# EAGLE schematic OSSI-1 COMMS (EAGLE 6.5.0)

## Sheet 1 of 4
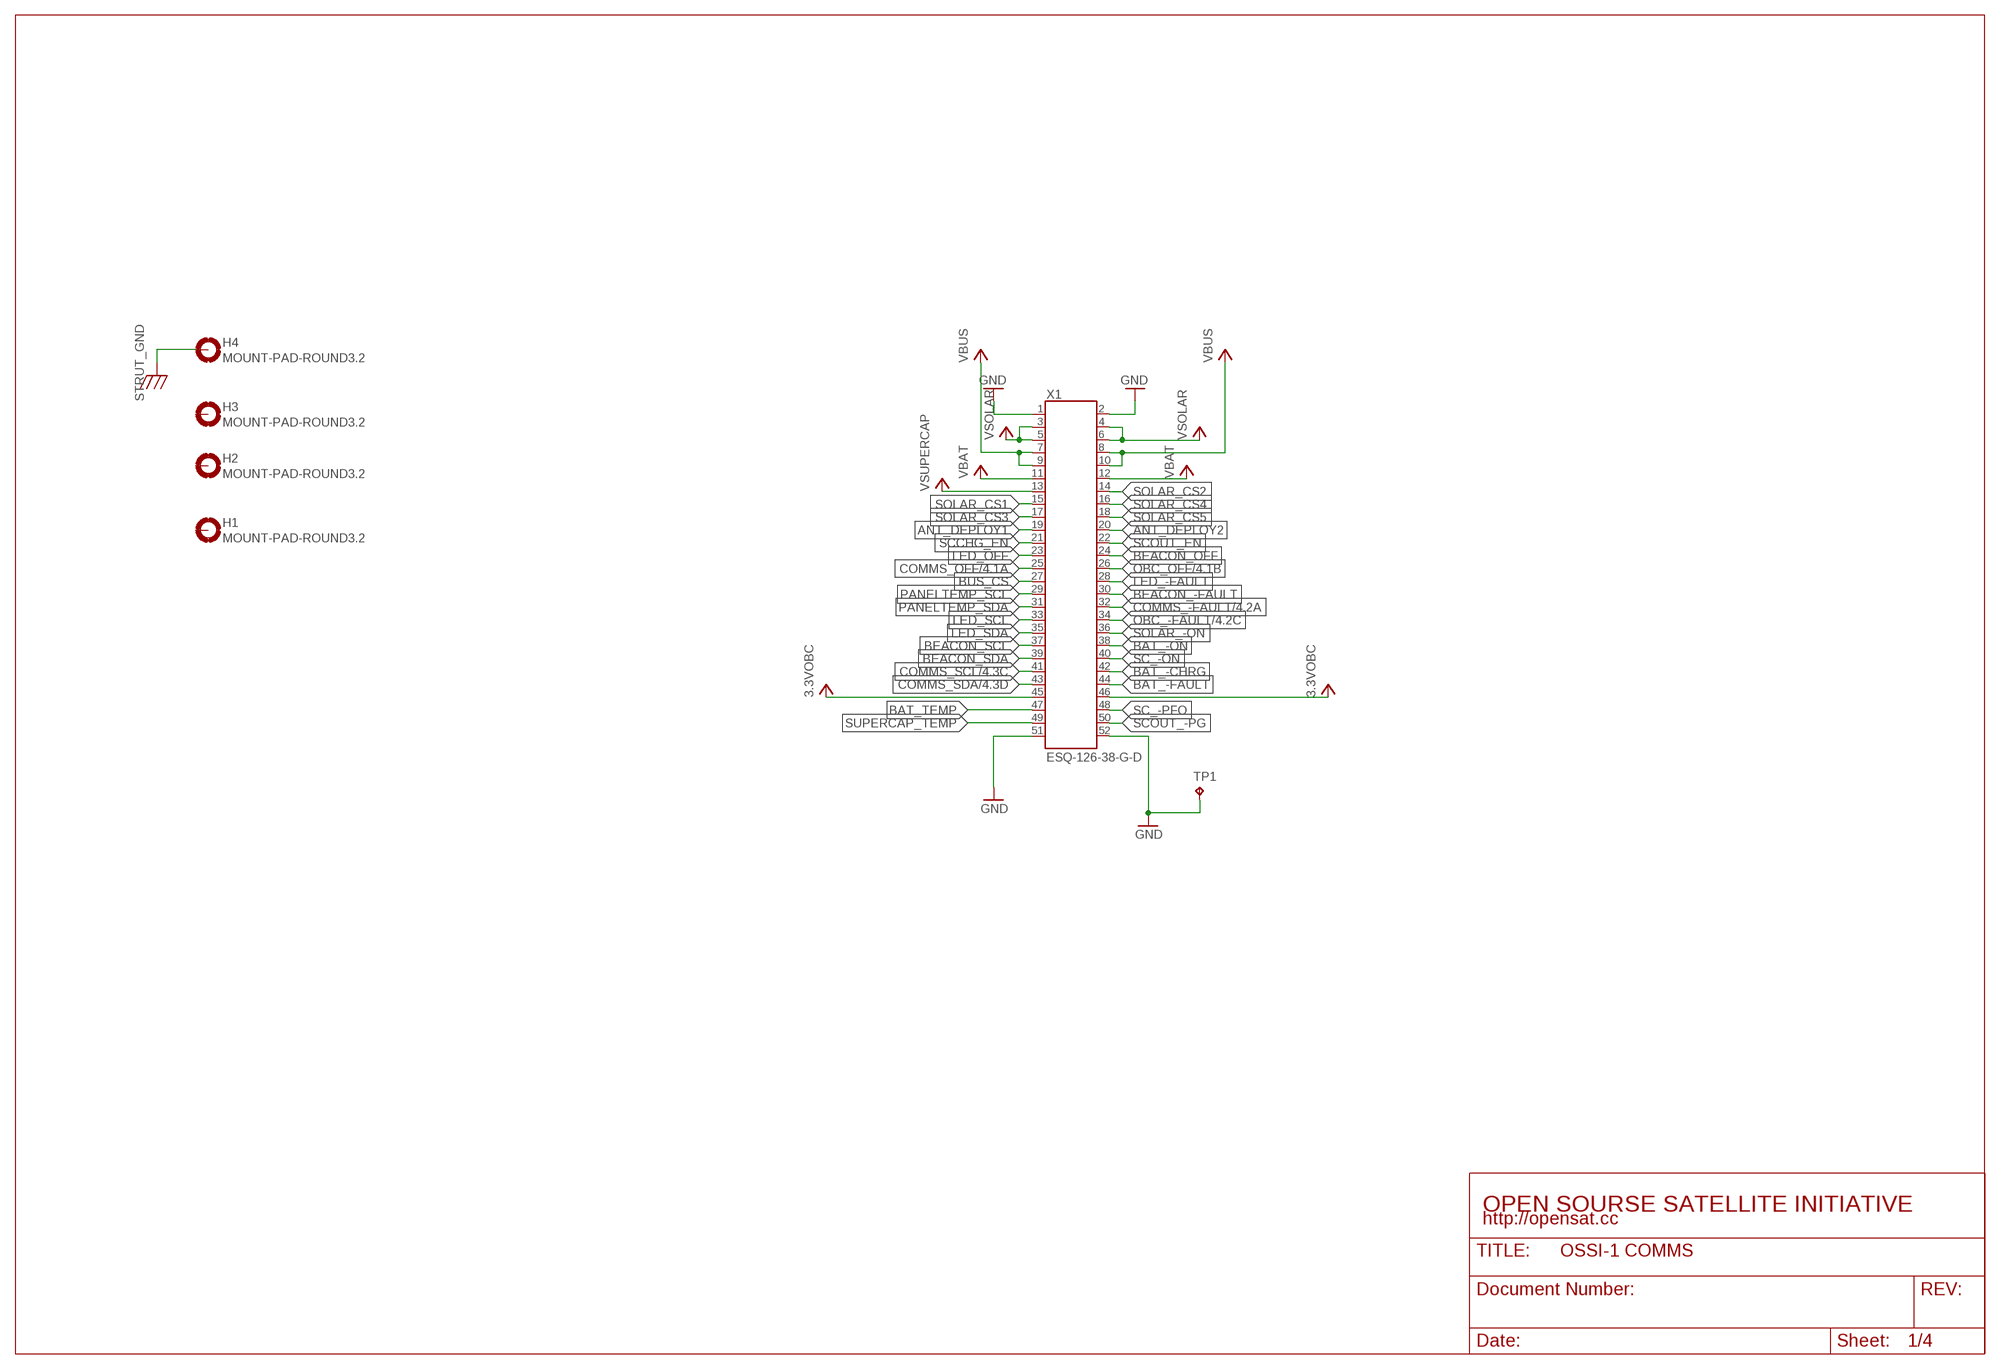
[diagram p0: schematic, sheet 1]

### Parts
H1  MOUNT-PAD-ROUND3.2  [3.2-PAD-ROUND]
H2  MOUNT-PAD-ROUND3.2  [3.2-PAD-ROUND]
H3  MOUNT-PAD-ROUND3.2  [3.2-PAD-ROUND]
H4  MOUNT-PAD-ROUND3.2  [3.2-PAD-ROUND]
TP1  TP  [TP-13]
X1  ESQ-126-38-G-D  [ESQ-126-XX-X-D]

### Nets
3.3VOBC: X1.45 X1.46
ANT_DEPLOY1: X1.19
ANT_DEPLOY2: X1.20
BAT_-CHRG: X1.42
BAT_-FAULT: X1.44
BAT_-ON: X1.38
BAT_TEMP: X1.47
BEACON_-FAULT: X1.30
BEACON_OFF: X1.24
BEACON_SCL: X1.37
BEACON_SDA: X1.39
BUS_CS: X1.27
COMMS_-FAULT: X1.32 ; also sheet 4
COMMS_OFF: X1.25 ; also sheet 4
COMMS_SCL: X1.41 ; also sheet 4
COMMS_SDA: X1.43 ; also sheet 4
GND: TP1.TP X1.1 X1.2 X1.51 X1.52 ; also sheet 2,3,4
LED_-FAULT: X1.28
LED_OFF: X1.23
LED_SCL: X1.33
LED_SDA: X1.35
OBC_-FAULT: X1.34 ; also sheet 4
OBC_OFF: X1.26 ; also sheet 4
PANELTEMP_SCL: X1.29
PANELTEMP_SDA: X1.31
SC_-ON: X1.40
SC_-PFO: X1.48
SCCHG_EN: X1.21
SCOUT_-PG: X1.50
SCOUT_EN: X1.22
SOLAR_-ON: X1.36
SOLAR_CS1: X1.15
SOLAR_CS2: X1.14
SOLAR_CS3: X1.17
SOLAR_CS4: X1.16
SOLAR_CS5: X1.18
STRUT_GND: H4.B3,2(MOUNT)
SUPERCAP_TEMP: X1.49
VBAT: X1.11 X1.12
VBUS: X1.7 X1.8 X1.9 X1.10 ; also sheet 2,4
VSOLAR: X1.3 X1.4 X1.5 X1.6
VSUPERCAP: X1.13
Unconnected: H1.B3,2(MOUNT) H2.B3,2(MOUNT) H3.B3,2(MOUNT)

### Notes on the sheet
- OPEN SOURSE SATELLITE INITIATIVE
- http://opensat.cc

## Sheet 2 of 4
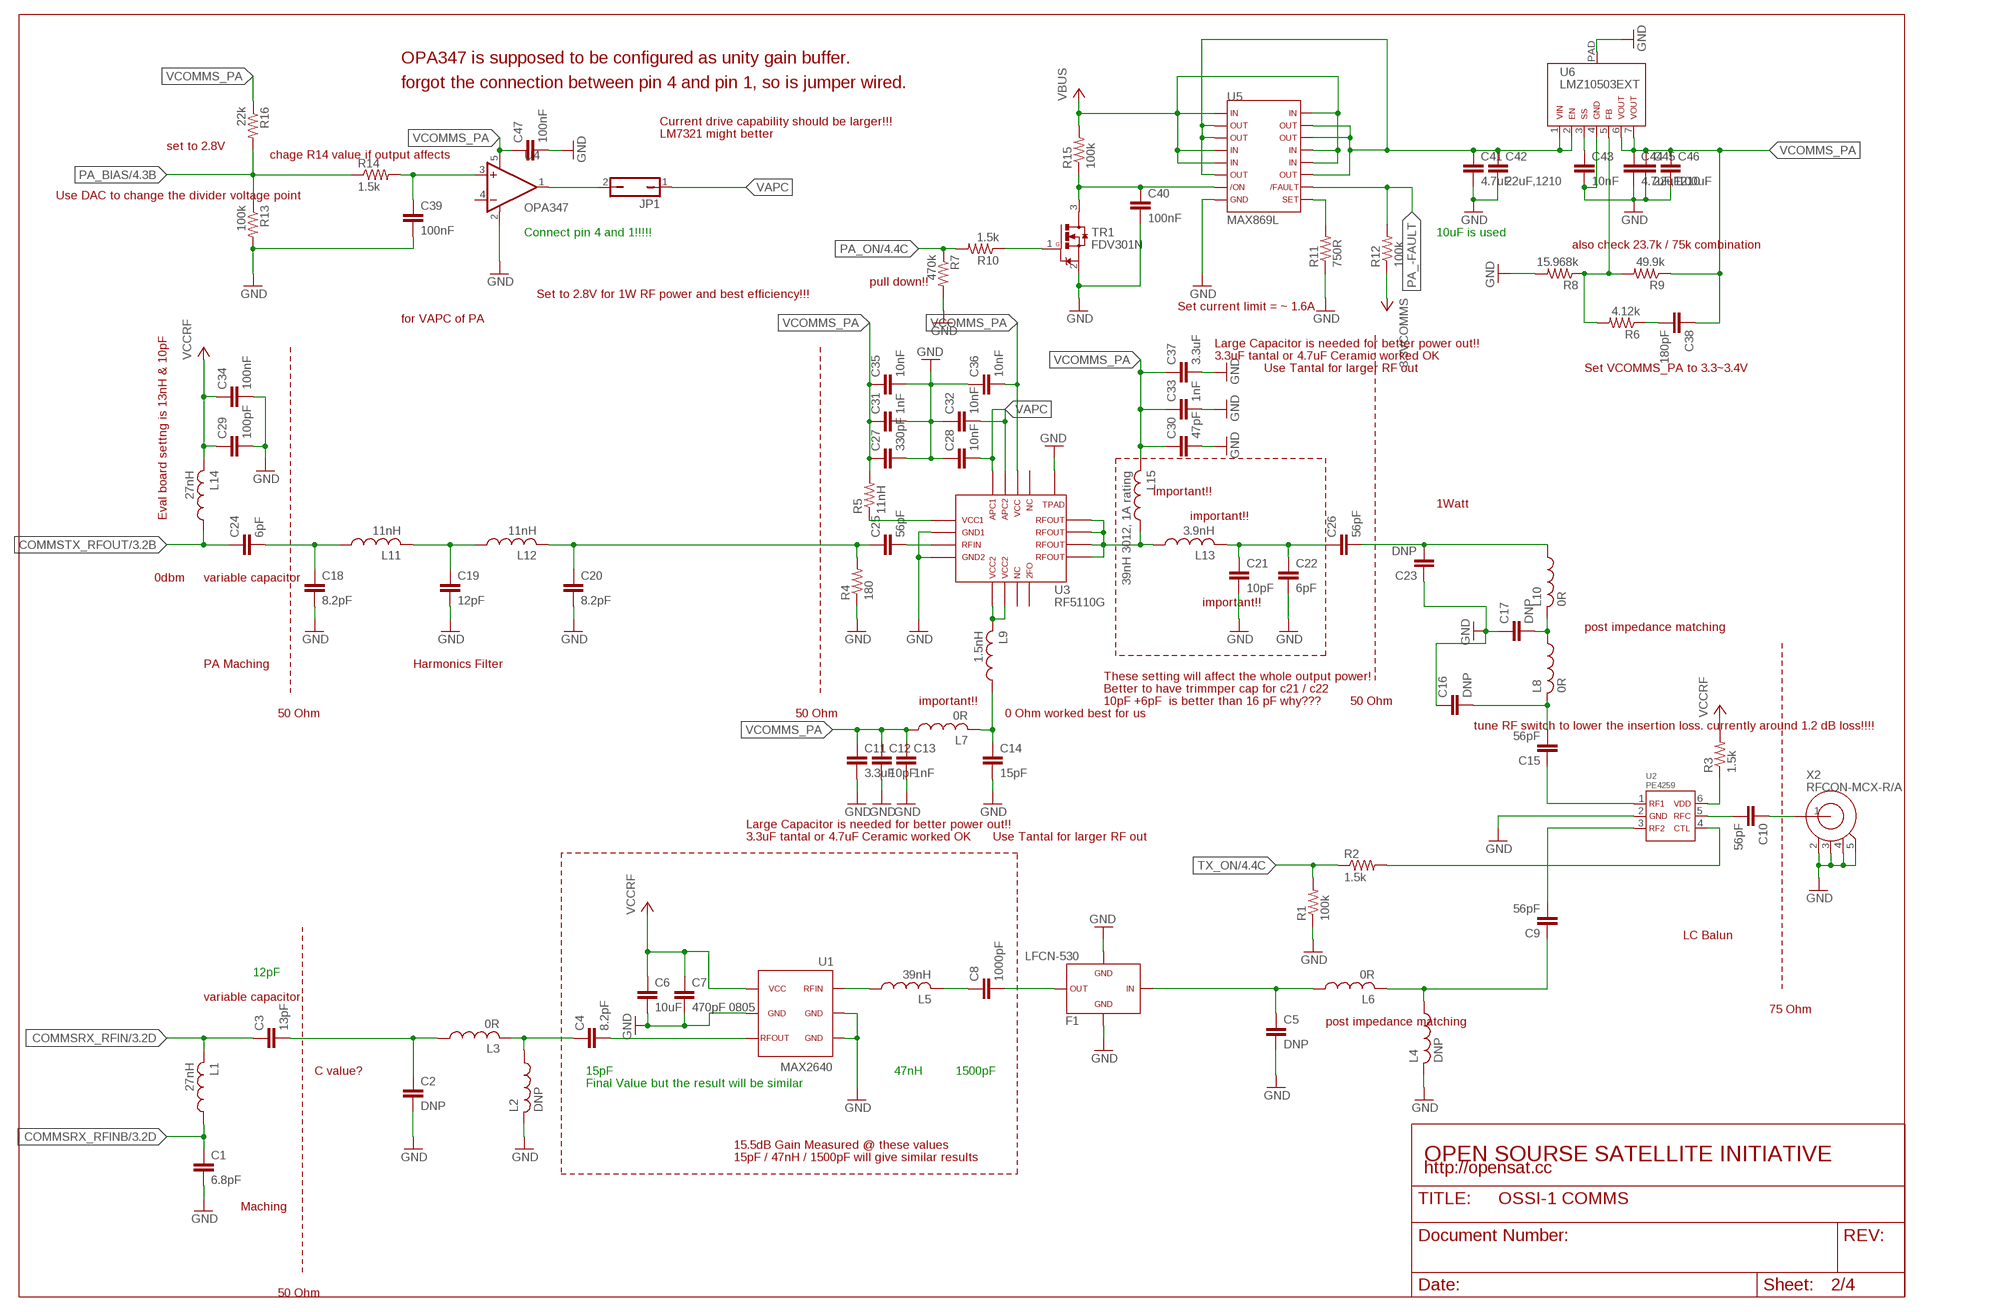
[diagram p1: schematic, sheet 2]

### Parts
C1  6.8pF  C0603(1608)  [C0603(1608)]
C2  DNP  C0603(1608)  [C0603(1608)]
C3  13pF  C0603(1608)  [C0603(1608)]
C4  8.2pF  C0603(1608)  [C0603(1608)]
C5  DNP  C0603(1608)  [C0603(1608)]
C6  10uF  C1206(3216)-GCM31  [C1206-GCM31]
C7  470pF 0805  C0805(2012)  [C0805(2012)]
C8  1000pF  C0603(1608)  [C0603(1608)]
C9  56pF  C0603(1608)  [C0603(1608)]
C10  56pF  C0603(1608)  [C0603(1608)]
C11  3.3uF  C1210(3225)-TMK325  [C1210-TMK325]
C12  10pF  C0603(1608)  [C0603(1608)]
C13  1nF  C0603(1608)  [C0603(1608)]
C14  15pF  C0603(1608)  [C0603(1608)]
C15  56pF  C0603(1608)  [C0603(1608)]
C16  DNP  C0603(1608)  [C0603(1608)]
C17  DNP  C0603(1608)  [C0603(1608)]
C18  8.2pF  C0603(1608)  [C0603(1608)]
C19  12pF  C0603(1608)  [C0603(1608)]
C20  8.2pF  C0603(1608)  [C0603(1608)]
C21  10pF  C0603(1608)  [C0603(1608)]
C22  6pF  C0603(1608)  [C0603(1608)]
C23  DNP  C0603(1608)  [C0603(1608)]
C24  6pF  C0603(1608)  [C0603(1608)]
C25  56pF  C0603(1608)  [C0603(1608)]
C26  56pF  C0603(1608)  [C0603(1608)]
C27  330pF  C0603(1608)  [C0603(1608)]
C28  10nF  C0603(1608)  [C0603(1608)]
C29  100pF  C0603(1608)  [C0603(1608)]
C30  47pF  C0603(1608)  [C0603(1608)]
C31  1nF  C0603(1608)  [C0603(1608)]
C32  10nF  C0603(1608)  [C0603(1608)]
C33  1nF  C0603(1608)  [C0603(1608)]
C34  100nF  C0603(1608)  [C0603(1608)]
C35  10nF  C0603(1608)  [C0603(1608)]
C36  10nF  C0603(1608)  [C0603(1608)]
C37  3.3uF  C1210(3225)-TMK325  [C1210-TMK325]
C38  180pF  C0603(1608)  [C0603(1608)]
C39  100nF  C0603(1608)  [C0603(1608)]
C40  100nF  C0603(1608)  [C0603(1608)]
C41  4.7uF  C1210(3225)-GCM32  [C1210-GCM32]
C42  22uF,1210  C1210(3225)-GCM32  [C1210-GCM32]
C43  10nF  C0603(1608)  [C0603(1608)]
C44  4.7uF,1210  C0805(2012)  [C0805(2012)]
C45  22uF  C1210(3225)-GCM32  [C1210-GCM32]
C46  100uF  C1210(3225)-GCM32  [C1210-GCM32]
C47  100nF  C0603(1608)  [C0603(1608)]
F1  LFCN-530  LFCN-160  [LFCN]
JP1  JP1Q  [JP1]
L1  27nH  L0603(1608)  [L0603(1608)]
L2  DNP  L0603(1608)  [L0603(1608)]
L3  0R  L0603(1608)  [L0603(1608)]
L4  DNP  L0603(1608)  [L0603(1608)]
L5  39nH  L0603(1608)  [L0603(1608)]
L6  0R  L0603(1608)  [L0603(1608)]
L7  0R  LLQH32CN  [LQH32CN331K23L]
L8  0R  L0603(1608)  [L0603(1608)]
L9  1.5nH  L0603(1608)  [L0603(1608)]
L10  0R  L0603(1608)  [L0603(1608)]
L11  11nH  L0603(1608)  [L0603(1608)]
L12  11nH  L0603(1608)  [L0603(1608)]
L13  3.9nH  L0603(1608)  [L0603(1608)]
L14  27nH  L0603(1608)  [L0603(1608)]
L15  39nH 3012, 1A rating  LNR3012  [NR3012]
R1  100k  R0603(1608)  [R0603(1608)]
R2  1.5k  R0603(1608)  [R0603(1608)]
R3  1.5k  R0603(1608)  [R0603(1608)]
R4  180  R0603(1608)  [R0603(1608)]
R5  11nH  R0603(1608)  [R0603(1608)]
R6  4.12k  R0603(1608)  [R0603(1608)]
R7  470k  R0603(1608)  [R0603(1608)]
R8  15.968k  R0603(1608)  [R0603(1608)]
R9  49.9k  R0603(1608)  [R0603(1608)]
R10  1.5k  R0603(1608)  [R0603(1608)]
R11  750R  R0603(1608)  [R0603(1608)]
R12  100k  R0603(1608)  [R0603(1608)]
R13  100k  R0603(1608)  [R0603(1608)]
R14  1.5k  R0603(1608)  [R0603(1608)]
R15  100k  R0603(1608)  [R0603(1608)]
R16  22k  R0603(1608)  [R0603(1608)]
TR1  FDV301N  [SOT23]
U1  MAX2640  [SOT23-6]
U2  PE4259  [SC70-6]
U3  RF5110G  [RF5110G]
U4  OPA347  [SOT23-5DBV]
U5  MAX869L  [16QSOP]
U6  LMZ10503EXT  [TO-PMOD-7]
X2  RFCON-MCX-R/A  [MCX-R/A]

### Nets
3.3VCOMMS: R12.1 ; also sheet 4
COMMSRX_RFIN: C3.1 L1.2 ; also sheet 3
COMMSRX_RFINB: C1.1 L1.1 ; also sheet 3
COMMSTX_RFOUT: C24.1 L14.1 ; also sheet 3
GND: C1.2 C2.2 C5.2 C6.P$2 C7.2 C11.P$2 C12.2 C13.2 C14.2 C16.1 C17.1 C18.2 C19.2 C20.2 C21.2 C22.2 C23.1 C27.2 C28.1 C29.2 C30.2 C31.2 C32.1 C33.2 C34.2 C35.2 C36.1 C37.P$2 C39.2 C40.2 C41.P$2 C42.P$2 C43.2 C44.2 C45.P$2 C46.P$2 C47.2 F1.2 F1.4 L2.2 L4.2 R1.1 R4.1 R7.2 R8.2 R11.1 R13.2 TR1.2(S) U1.2 U1.3 U1.5 U2.2 U3.2 U3.4 U3.TPAD U4.2(V-) U5.8 U6.4 U6.PAD X2.2 X2.3 X2.4 X2.5 ; also sheet 1,3,4
N$4: C23.2 C26.2 L10.1
N$7: L5.1 U1.1
N$8: C8.1 L5.2
N$14: C4.2 U1.4
N$15: C5.1 F1.1 L6.1
N$16: C8.2 F1.3
N$21: C9.1 L4.1 L6.2
N$23: C17.2 L8.1 L10.2
N$33: C20.1 C25.1 L12.2 R4.2
N$36: C18.1 C24.2 L11.1
N$37: C19.1 L11.2 L12.1
N$39: C15.2 C16.2 L8.2
N$41: C10.2 U2.5
N$42: R2.2 U2.4
N$43: C4.1 L2.1 L3.2
N$44: R3.1 U2.6
N$46: C10.1 X2.1
N$47: C40.1 R15.1 TR1.3(D) U5.7
N$50: C43.1 U6.3
N$51: R10.1 TR1.1(G)
N$52: C41.P$1 C42.P$1 U5.2 U5.3 U5.6 U5.11 U5.14 U5.15 U6.1 U6.2
N$53: R6.2 R8.1 R9.2 U6.5
N$54: C38.2 R6.1
N$55: R11.2 U5.9
N$58: C15.1 U2.1
N$59: C9.2 U2.3
N$62: C2.1 C3.2 L3.1
N$70: C39.1 R14.2 U4.3(+IN)
N$71: C21.1 C22.1 C26.1 L13.2
N$72: L9.2 U3.5 U3.6
N$73: C25.2 U3.3
N$75: L13.1 L15.P$1 U3.9 U3.10 U3.11 U3.12
N$76: JP1.2 U4.1(OUT)
N$79: C14.1 L7.P$2 L9.1
N$80: R5.1 U3.1
PA_-FAULT: R12.2 U5.10
PA_BIAS: R13.1 R14.1 R16.2 ; also sheet 4
PA_ON: R7.1 R10.2 ; also sheet 4
TX_ON: R1.2 R2.1 ; also sheet 4
VAPC: C28.2 C32.2 JP1.1 U3.15 U3.16
VBUS: R15.2 U5.1 U5.4 U5.5 U5.12 U5.13 U5.16 ; also sheet 1,4
VCCRF: C6.P$1 C7.1 C29.1 C34.1 L14.2 R3.2 U1.6 ; also sheet 3,4
VCOMMS_PA: C11.P$1 C12.1 C13.1 C27.1 C30.1 C31.1 C33.1 C35.1 C36.2 C37.P$1 C38.1 C44.1 C45.P$1 C46.P$1 C47.1 L7.P$1 L15.P$2 R5.2 R9.1 R16.1 U3.14 U4.5(V+) U6.6 U6.7
Unconnected: U3.7 U3.8 U3.13 U4.4(-IN)

### Notes on the sheet
- OPA347 is supposed to be configured as unity gain buffer.
- forgot the connection between pin 4 and pin 1, so is jumper wired.
- Current drive capability should be larger!!!
- LM7321 might better
- set to 2.8V | chage R14 value if output affects
- Use DAC to change the divider voltage point
- Connect pin 4 and 1!!!!! | 10uF is used
- also check 23.7k / 75k combination
- pull down!!
- Set to 2.8V for 1W RF power and best efficiency!!!
- Set current limit = ~ 1.6A
- for VAPC of PA
- Large Capacitor is needed for better power out!!
- 3.3uF tantal or 4.7uF Ceramic worked OK
- Use Tantal for larger RF out | Set VCOMMS_PA to 3.3~3.4V
- important!!
- 1Watt
- Eval board settng is 13nH & 10pF | important!!
- 0dbm | variable capacitor
- important!!
- post impedance matching
- PA Maching | Harmonics Filter
- These setting will affect the whole output power!
- Better to have trimmper cap for c21 / c22
- important!! | 10pF +6pF  is better than 16 pF why??? | 50 Ohm
- 50 Ohm | 50 Ohm | 0 Ohm worked best for us
- tune RF switch to lower the insertion loss. currently around 1.2 dB loss!!!!
- Large Capacitor is needed for better power out!!
- 3.3uF tantal or 4.7uF Ceramic worked OK | Use Tantal for larger RF out
- LC Balun
- 12pF
- variable capacitor
- 75 Ohm
- post impedance matching
- C value? | 15pF | 47nH | 1500pF
- Final Value but the result will be similar
- 15.5dB Gain Measured @ these values
- 15pF / 47nH / 1500pF will give similar results | OPEN SOURSE SATELLITE INITIATIVE
- http://opensat.cc
- Maching
- 50 Ohm

## Sheet 3 of 4
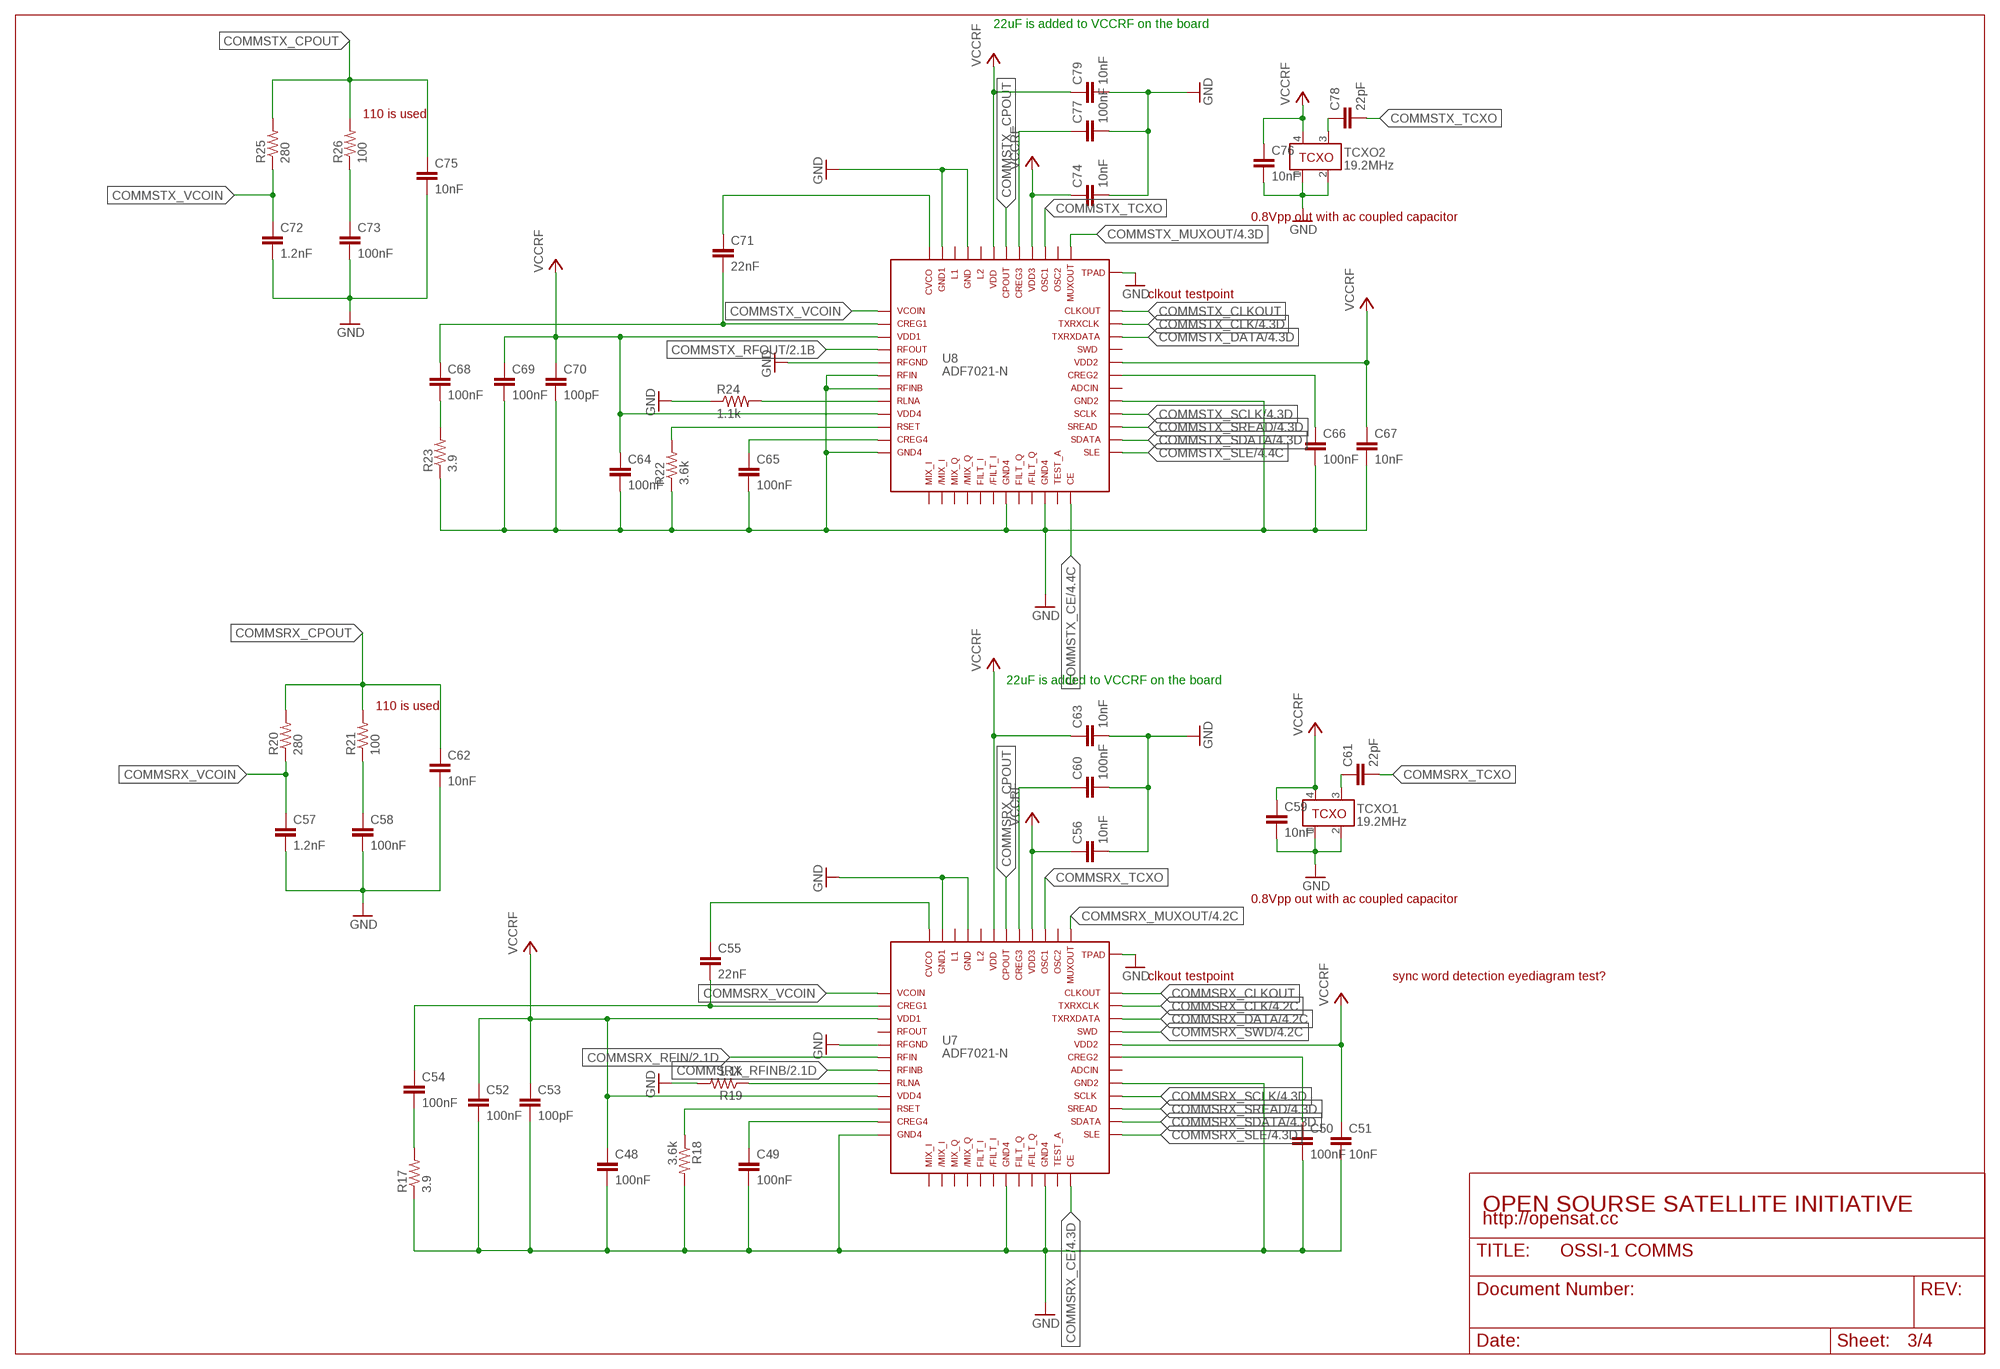
[diagram p2: schematic, sheet 3]

### Parts
C48  100nF  C0603(1608)  [C0603(1608)]
C49  100nF  C0603(1608)  [C0603(1608)]
C50  100nF  C0603(1608)  [C0603(1608)]
C51  10nF  C0603(1608)  [C0603(1608)]
C52  100nF  C0603(1608)  [C0603(1608)]
C53  100pF  C0603(1608)  [C0603(1608)]
C54  100nF  C0603(1608)  [C0603(1608)]
C55  22nF  C0603(1608)  [C0603(1608)]
C56  10nF  C0603(1608)  [C0603(1608)]
C57  1.2nF  C0603(1608)  [C0603(1608)]
C58  100nF  C0603(1608)  [C0603(1608)]
C59  10nF  C0603(1608)  [C0603(1608)]
C60  100nF  C0603(1608)  [C0603(1608)]
C61  22pF  C0603(1608)  [C0603(1608)]
C62  10nF  C0603(1608)  [C0603(1608)]
C63  10nF  C0603(1608)  [C0603(1608)]
C64  100nF  C0603(1608)  [C0603(1608)]
C65  100nF  C0603(1608)  [C0603(1608)]
C66  100nF  C0603(1608)  [C0603(1608)]
C67  10nF  C0603(1608)  [C0603(1608)]
C68  100nF  C0603(1608)  [C0603(1608)]
C69  100nF  C0603(1608)  [C0603(1608)]
C70  100pF  C0603(1608)  [C0603(1608)]
C71  22nF  C0603(1608)  [C0603(1608)]
C72  1.2nF  C0603(1608)  [C0603(1608)]
C73  100nF  C0603(1608)  [C0603(1608)]
C74  10nF  C0603(1608)  [C0603(1608)]
C75  10nF  C0603(1608)  [C0603(1608)]
C76  10nF  C0603(1608)  [C0603(1608)]
C77  100nF  C0603(1608)  [C0603(1608)]
C78  22pF  C0603(1608)  [C0603(1608)]
C79  10nF  C0603(1608)  [C0603(1608)]
R17  3.9  R0603(1608)  [R0603(1608)]
R18  3.6k  R0603(1608)  [R0603(1608)]
R19  1.1k  R0603(1608)  [R0603(1608)]
R20  280  R0603(1608)  [R0603(1608)]
R21  100  R0603(1608)  [R0603(1608)]
R22  3.6k  R0603(1608)  [R0603(1608)]
R23  3.9  R0603(1608)  [R0603(1608)]
R24  1.1k  R0603(1608)  [R0603(1608)]
R25  280  R0603(1608)  [R0603(1608)]
R26  100  R0603(1608)  [R0603(1608)]
TCXO1  19.2MHz  TCXO-M532  [TCXO_M532]
TCXO2  19.2MHz  TCXO-M532  [TCXO_M532]
U7  ADF7021-N  [LFCSP48]
U8  ADF7021-N  [LFCSP48]

### Nets
COMMSRX_CE: U7.24 ; also sheet 4
COMMSRX_CLK: U7.35 ; also sheet 4
COMMSRX_CLKOUT: U7.36
COMMSRX_CPOUT: C62.1 R20.2 R21.2 U7.42
COMMSRX_DATA: U7.34 ; also sheet 4
COMMSRX_MUXOUT: U7.37 ; also sheet 4
COMMSRX_RFIN: U7.6 ; also sheet 2
COMMSRX_RFINB: U7.7 ; also sheet 2
COMMSRX_SCLK: U7.28 ; also sheet 4
COMMSRX_SDATA: U7.26 ; also sheet 4
COMMSRX_SLE: U7.25 ; also sheet 4
COMMSRX_SREAD: U7.27 ; also sheet 4
COMMSRX_SWD: U7.33 ; also sheet 4
COMMSRX_TCXO: C61.2 U7.39
COMMSRX_VCOIN: C57.1 R20.1 U7.1
COMMSTX_CE: U8.24 ; also sheet 4
COMMSTX_CLK: U8.35 ; also sheet 4
COMMSTX_CLKOUT: U8.36
COMMSTX_CPOUT: C75.1 R25.2 R26.2 U8.42
COMMSTX_DATA: U8.34 ; also sheet 4
COMMSTX_MUXOUT: U8.37 ; also sheet 4
COMMSTX_RFOUT: U8.4 ; also sheet 2
COMMSTX_SCLK: U8.28 ; also sheet 4
COMMSTX_SDATA: U8.26 ; also sheet 4
COMMSTX_SLE: U8.25 ; also sheet 4
COMMSTX_SREAD: U8.27 ; also sheet 4
COMMSTX_TCXO: C78.2 U8.39
COMMSTX_VCOIN: C72.1 R25.1 U8.1
GND: C48.2 C49.2 C50.2 C51.2 C52.2 C53.2 C56.2 C57.2 C58.2 C59.2 C60.2 C62.2 C63.2 C64.2 C65.2 C66.2 C67.2 C69.2 C70.2 C72.2 C73.2 C74.2 C75.2 C76.2 C77.2 C79.2 R17.1 R18.2 R19.2 R22.1 R23.1 R24.1 TCXO1.1 TCXO1.2 TCXO2.1 TCXO2.2 U7.5 U7.12 U7.19 U7.22 U7.29 U7.45 U7.47 U7.EXP U8.5 U8.6 U8.7 U8.12 U8.19 U8.22 U8.29 U8.45 U8.47 U8.EXP ; also sheet 1,2,4
N$1: C60.1 U7.41
N$3: C65.1 U8.11
N$9: C50.1 U7.31
N$10: C49.1 U7.11
N$22: C55.1 U7.48
N$24: R19.1 U7.8
N$25: R18.1 U7.10
N$26: C54.2 R17.2
N$27: C71.1 U8.48
N$28: R22.2 U8.10
N$29: C68.2 R23.2
N$30: R24.2 U8.8
N$31: C77.1 U8.41
N$32: C66.1 U8.31
N$34: C68.1 C71.2 U8.2
N$35: C54.1 C55.2 U7.2
N$38: C73.1 R26.1
N$40: C58.1 R21.1
N$66: C61.1 TCXO1.3
N$68: C78.1 TCXO2.3
VCCRF: C48.1 C51.1 C52.1 C53.1 C56.1 C59.1 C63.1 C64.1 C67.1 C69.1 C70.1 C74.1 C76.1 C79.1 TCXO1.4 TCXO2.4 U7.3 U7.9 U7.32 U7.40 U7.43 U8.3 U8.9 U8.32 U8.40 U8.43 ; also sheet 2,4
Unconnected: U7.4 U7.13 U7.14 U7.15 U7.16 U7.17 U7.18 U7.20 U7.21 U7.23 U7.30 U7.38 U7.44 U7.46 U8.13 U8.14 U8.15 U8.16 U8.17 U8.18 U8.20 U8.21 U8.23 U8.30 U8.33 U8.38 U8.44 U8.46

### Notes on the sheet
- 22uF is added to VCCRF on the board
- 110 is used
- 0.8Vpp out with ac coupled capacitor
- clkout testpoint
- 22uF is added to VCCRF on the board
- 110 is used
- 0.8Vpp out with ac coupled capacitor
- clkout testpoint | sync word detection eyediagram test?
- OPEN SOURSE SATELLITE INITIATIVE
- http://opensat.cc

## Sheet 4 of 4
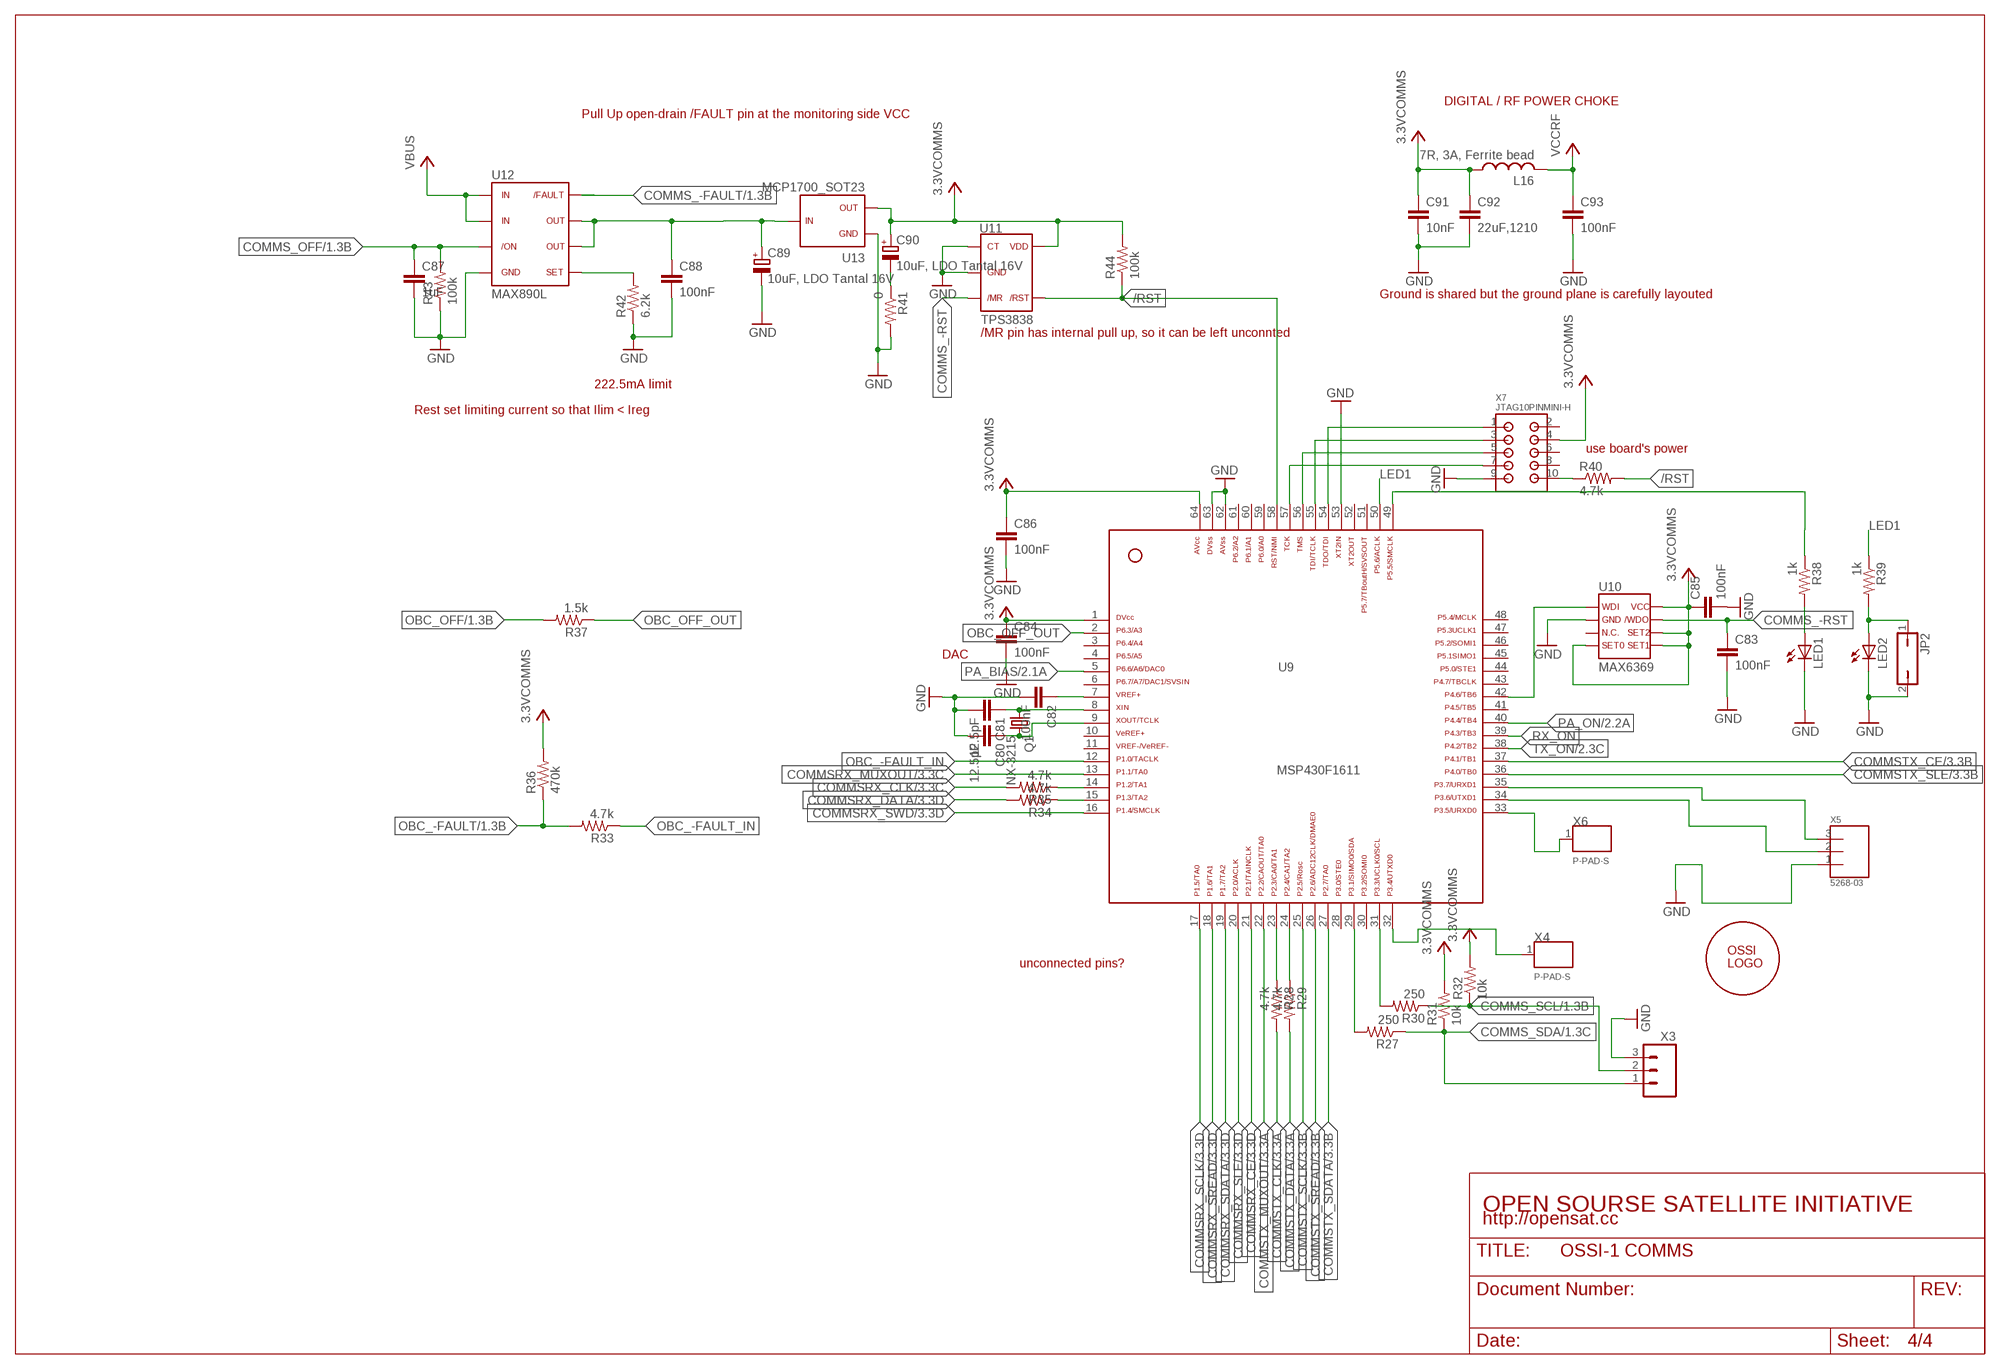
[diagram p3: schematic, sheet 4]

### Parts
C80  12.5pF  C0603(1608)  [C0603(1608)]
C81  12.5pF  C0603(1608)  [C0603(1608)]
C82  100nF  C0603(1608)  [C0603(1608)]
C83  100nF  C0603(1608)  [C0603(1608)]
C84  100nF  C0603(1608)  [C0603(1608)]
C85  100nF  C0603(1608)  [C0603(1608)]
C86  100nF  C0603(1608)  [C0603(1608)]
C87  1uF  C0603(1608)  [C0603(1608)]
C88  100nF  C0603(1608)  [C0603(1608)]
C89  10uF, LDO Tantal 16V  C-TANTAL-A  [C1206(3216)-A]
C90  10uF, LDO Tantal 16V  C-TANTAL-A  [C1206(3216)-A]
C91  10nF  C0603(1608)  [C0603(1608)]
C92  22uF,1210  C1210(3225)-GCM32  [C1210-GCM32]
C93  100nF  C0603(1608)  [C0603(1608)]
JP2  JP1Q  [JP1]
L16  7R, 3A, Ferrite bead  L0805(2012)  [L0805(2012)]
LED1  LEDCHIPLED_0603  [CHIPLED_0603]
LED2  LEDCHIPLED_0603  [CHIPLED_0603]
Q1  NX-3215  [NX-3215]
R27  250  R0603(1608)  [R0603(1608)]
R28  4.7k  R0603(1608)  [R0603(1608)]
R29  4.7k  R0603(1608)  [R0603(1608)]
R30  250  R0603(1608)  [R0603(1608)]
R31  10k  R0603(1608)  [R0603(1608)]
R32  10k  R0603(1608)  [R0603(1608)]
R33  4.7k  R0603(1608)  [R0603(1608)]
R34  4.7k  R0603(1608)  [R0603(1608)]
R35  4.7k  R0603(1608)  [R0603(1608)]
R36  470k  R0603(1608)  [R0603(1608)]
R37  1.5k  R0603(1608)  [R0603(1608)]
R38  1k  R0603(1608)  [R0603(1608)]
R39  1k  R0603(1608)  [R0603(1608)]
R40  4.7k  R0603(1608)  [R0603(1608)]
R41  0  R0603(1608)  [R0603(1608)]
R42  6.2k  R0603(1608)  [R0603(1608)]
R43  100k  R0603(1608)  [R0603(1608)]
R44  100k  R0603(1608)  [R0603(1608)]
U9  MSP430F1611  [PM/PAG64]
U10  MAX6369  [SOT23-8]
U11  TPS3838  [SOT23-5DBV]
U12  MAX890L  [SO8]
U13  MCP1700_SOT23  [SOT23]
U$1  OSSILOGORECT  [OSSILOGORECT1005]
X3  M03PTH  [1X03]
X4  P-PAD-S  [P-PAD-S]
X5  5268-03  [5268-03]
X6  P-PAD-S  [P-PAD-S]
X7  JTAG10PINMINI-H  [M50-3200545]

### Nets
3.3VCOMMS: C84.1 C85.1 C86.1 C90.1(+) C91.1 C92.P$1 L16.1 R31.2 R32.2 R36.2 R44.2 U9.1 U9.64 U10.4 U10.5 U10.6 U10.8 U11.5 U13.2 X7.4 ; also sheet 2
/RST: R40.2 R44.1 U9.58 U11.4
COMMS_-FAULT: U12.8 ; also sheet 1
COMMS_-RST: C83.1 U10.7 U11.3
COMMS_OFF: C87.1 R43.2 U12.3 ; also sheet 1
COMMS_SCL: R30.1 R32.1 X3.2 ; also sheet 1
COMMS_SDA: R27.1 R31.1 X3.1 ; also sheet 1
COMMSRX_CE: U9.21 ; also sheet 3
COMMSRX_CLK: R35.2 ; also sheet 3
COMMSRX_DATA: R34.2 ; also sheet 3
COMMSRX_MUXOUT: U9.13 ; also sheet 3
COMMSRX_SCLK: U9.17 ; also sheet 3
COMMSRX_SDATA: U9.19 ; also sheet 3
COMMSRX_SLE: U9.20 ; also sheet 3
COMMSRX_SREAD: U9.18 ; also sheet 3
COMMSRX_SWD: U9.16 ; also sheet 3
COMMSTX_CE: U9.37 ; also sheet 3
COMMSTX_CLK: R28.2 ; also sheet 3
COMMSTX_DATA: R29.2 ; also sheet 3
COMMSTX_MUXOUT: U9.22 ; also sheet 3
COMMSTX_SCLK: U9.25 ; also sheet 3
COMMSTX_SDATA: U9.27 ; also sheet 3
COMMSTX_SLE: U9.36 ; also sheet 3
COMMSTX_SREAD: U9.26 ; also sheet 3
GND: C80.2 C81.2 C82.2 C83.2 C84.2 C85.2 C86.2 C87.2 C88.2 C89.2(-) C91.2 C92.P$2 C93.2 JP2.2 LED1.C LED2.C R41.2 R42.1 R43.1 U9.53 U9.62 U9.63 U10.2 U11.1 U11.2 U12.4 U13.1 X3.3 X5.1 X7.9 ; also sheet 1,2,3
LED1: R39.1 U9.50
N$2: R40.1 X7.10
N$5: C81.1 Q1.1 U9.8
N$6: C80.1 Q1.2 U9.9
N$11: C88.1 C89.1(+) U12.6 U12.7 U13.3
N$12: R42.2 U12.5
N$13: C82.1 U9.7
N$17: U9.57 X7.7
N$18: U9.56 X7.5
N$19: U9.55 X7.3
N$20: U9.54 X7.1
N$45: LED1.A R38.2
N$48: R38.1 U9.49
N$49: JP2.1 LED2.A R39.2
N$56: U9.35 X5.3
N$57: U9.34 X5.2
N$60: R27.2 U9.29
N$61: R30.2 U9.31
N$63: R34.1 U9.15
N$64: R35.1 U9.14
N$65: R28.1 U9.23
N$67: R29.1 U9.24
N$69: U9.42 U10.1
N$74: C90.2(-) R41.1
N$77: U9.33 X6.1
N$78: U9.32 X4.1
OBC_-FAULT: R33.2 R36.1 ; also sheet 1
OBC_-FAULT_IN: R33.1 U9.12
OBC_OFF: R37.2 ; also sheet 1
OBC_OFF_OUT: R37.1 U9.2
PA_BIAS: U9.5 ; also sheet 2
PA_ON: U9.40 ; also sheet 2
RX_ON: U9.39
TX_ON: U9.38 ; also sheet 2
VBUS: U12.1 U12.2 ; also sheet 1,2
VCCRF: C93.1 L16.2 ; also sheet 2,3
Unconnected: U9.3 U9.4 U9.6 U9.10 U9.11 U9.28 U9.30 U9.41 U9.43 U9.44 U9.45 U9.46 U9.47 U9.48 U9.51 U9.52 U9.59 U9.60 U9.61 U10.3 X7.2 X7.6 X7.8

### Notes on the sheet
- DIGITAL / RF POWER CHOKE
- Pull Up open-drain /FAULT pin at the monitoring side VCC
- Ground is shared but the ground plane is carefully layouted
- /MR pin has internal pull up, so it can be left unconnted
- 222.5mA limit
- Rest set limiting current so that Ilim < Ireg
- use board's power
- DAC
- unconnected pins?
- OPEN SOURSE SATELLITE INITIATIVE
- http://opensat.cc

## Library data of the parts
C1-C88 C91-C93 = OSSI:C
C89 C90 = OSSI:C-TANTAL-A: TAJA105M020RNJ Tantal Capacitor Manufacturer: AVX 1206(3126) Ref: www.avx.com/docs/techinfo/tantappl.pdf
F1 = OSSI:LFCN-160: LFCN-160 Low Pass Filter DC - 160MHz Low Pass Filter Cut Off Freq: 230MHz 8W power rating ( degraded to 3W at 100 celcius degree)
H1-H4 = OSSI:MOUNT-PAD-ROUND
JP1 JP2 = OSSI:JP1Q: JUMPER
L1-L16 = OSSI:L
LED1 LED2 = led:LED: LED OSRAM: - CHIPLED LG R971, LG N971, LY N971, LG Q971, LY Q971, LO R971, LY R971 LH N974, LH R974 LS Q976, LO Q976, LY Q976 LO Q996 - Hyper CHIPLED LW Q18S LB Q993, LB Q99A, LB R99A - SideLED LS A670, LO A670, LY A670, LG A670, LP A670 LB A673, LV A673, LT A673, LW A673 LH A674 LY A675 LS A676, LA A676, LO A676, LY A676, LW A676 LS A679, LY A679, LG A679 - Hyper Micro SIDELED® LS Y876, LA Y876, LO Y876, LY Y876 LT Y87S - SmartLED LW L88C, LW L88S LB L89C, LB L89S, LG L890 LS L89K, LO L89K, LY L89K LS L896, LA L896, LO L896, LY L896 - TOPLED LS T670, LO T670, LY T670, LG T670, LP T670 LSG T670, LSP T670, LSY T670, LOP T670, LYG T670 LG T671, LOG T671, LSG T671 LB T673, LV T673, LT T673, LW T673 LH T674 LS T676, LA T676, LO T676, LY T676, LB T676, LH T676, LSB T676, LW T676 LB T67C, LV T67C, LT T67C, LS T67K, LO T67K, LY T67K, LW E67C LS E67B, LA E67B, LO E67B, LY E67B, LB E67C, LV E67C, LT E67C LW T67C LS T679, LY T679, LG T679 LS T770, LO T770, LY T770, LG T770, LP T770 LB T773, LV T773, LT T773, LW T773 LH T774 LS E675, LA E675, LY E675, LS T675 LS T776, LA T776, LO T776, LY T776, LB T776 LHGB T686 LT T68C, LB T68C - Hyper Mini TOPLED® LB M676 - Mini TOPLED Santana® LG M470 LS M47K, LO M47K, LY M47K Source: http://www.osram.convergy.de LUXEON: - LUMILED® LXK2-PW12-R00, LXK2-PW12-S00, LXK2-PW14-U00, LXK2-PW14-V00 LXK2-PM12-R00, LXK2-PM12-S00, LXK2-PM14-U00 LXK2-PE12-Q00, LXK2-PE12-R00, LXK2-PE12-S00, LXK2-PE14-T00, LXK2-PE14-U00 LXK2-PB12-K00, LXK2-PB12-L00, LXK2-PB12-M00, LXK2-PB14-N00, LXK2-PB14-P00, LXK2-PB14-Q00 LXK2-PR12-L00, LXK2-PR12-M00, LXK2-PR14-Q00, LXK2-PR14-R00 LXK2-PD12-Q00, LXK2-PD12-R00, LXK2-PD12-S00 LXK2-PH12-R00, LXK2-PH12-S00 LXK2-PL12-P00, LXK2-PL12-Q00, LXK2-PL12-R00 Source: www.luxeon.com KINGBRIGHT: KA-3528ASYC Source: www.kingbright.com
Q1 = OSSI:NX-3215: NDK 32.768 kHz SMD Crystal P/N: NX3215SA-32.768K-STD-MUA-9 Nominal frequency (kHz): 32.768 Package Size (L×W×H : mm): 3.2×1.5×0.8 Operating Temperature Range(*1) / Storage Temperature Range (°C): -40 to +85 / -40 to +85 Level of drive: 0.1µW (Max. 0.5µW) Frequency Tolerance (25±3°C): ±20×10-6 Load Capacitance: 9.0pF, 12.5pF Equivalent Series Resistance: 70kΩ Max. Ordering Code: NX3215SA-32.768K-STD-MUA-9 (Load Capacitance9.0pF) /NX3215SA-32.768K-STD-MUA-8 (Load Capacitance12.5pF)
R1-R44 = OSSI:R
TCXO1 TCXO2 = OSSI:TCXO-M532: 532L25DT19M2000: CTO electronic components Model 532 19.2MHz TCXO for RF transeiver Clipped Sine Wave Output Operating Voltage, +3.3Vdc Operating Temperature to -30°C to +85°C Frequency Stability: ±2.5ppm
TP1 = OSSI:TP
TR1 = OSSI:FDV301N: FDV301N Digital N channel - FET / Rdson = 5 Ohm / Vgs = 0.7~1.06V / Ids = 220mA
U1 = OSSI:MAX2640: MAX2640 ultra-low-noise amplifiers operating frequency: 300MHz to 2500MHz +2.7V to +5.5V Single-Supply Operation Low 3.5mA Supply Current
U2 = OSSI:PE4259
U3 = OSSI:RF5110G: RF5110G 3V GSM RF Power Amplifirer +36dBm Output Power at 3.5V
U4 = OSSI:OPA347: OPA347 RAIL-TO-RAIL INPUT AND OUTPUT SINGLE SUPPLY: 2.3V to 5.5V LOW IQ: 20µ
U5 = OSSI:MAX869L: 2A, Current-Limited, High-Side P-Channel Switch with Thermal Shutdown
U6 = OSSI:LMZ10503EXT: LMZ10503EXT June 14, 2011 3A SIMPLE SWITCHER® Power Module with 5.5V Maximum Input Voltage for Military and Rugged Applications
U7 U8 = OSSI:ADF7021-N: ADF7021-N RF transceiver from analog device
U9 = OSSI:MSP430F1611: MSP430F1611
U10 = OSSI:MAX6369: MAX6369 Pin-Selectable Watchdog Timers Max 6369 is Open-drain output 1 ms to 60 s seletable timeout
U11 = OSSI:TPS3838: TPS3838 NanoPower Supervisory IC from texas instruments. TPS3838 is open-drain output
U12 = OSSI:MAX890L: MAX 890L 1.2A, Current-Limited, High-Side P-Channel Switch with Thermal Shutdown BY MAXIM
U13 = OSSI:MCP1700: MCP1700 LDO from Microchips
U$1 = OSSI:OSSILOGO
X1 = OSSI:ESQ-126-: Samtec ESQ-126-XX-G-D Elevated Sockets Seires ESQ-126-37-G-D ESQ-126-38-G-D ESQ-126-39-G-D
X2 = OSSI:RFCON: RF Connectors
X3 = OSSI:M03: Header 3 Standard 3-pin 0.1" header. Use with straight break away headers (SKU : PRT-00116), right angle break away headers (PRT-00553), swiss pins (PRT-00743), machine pins (PRT-00117), and female headers (PRT-00115). Molex polarized connector foot print use with SKU : PRT-08232 with associated crimp pins and housings.
X4 X6 = OSSI:P-PAD
X5 = OSSI:5268-03
X7 = OSSI:JTAG10PINMINI